# EAGLE schematic maincontroller (EAGLE 7.2.0)
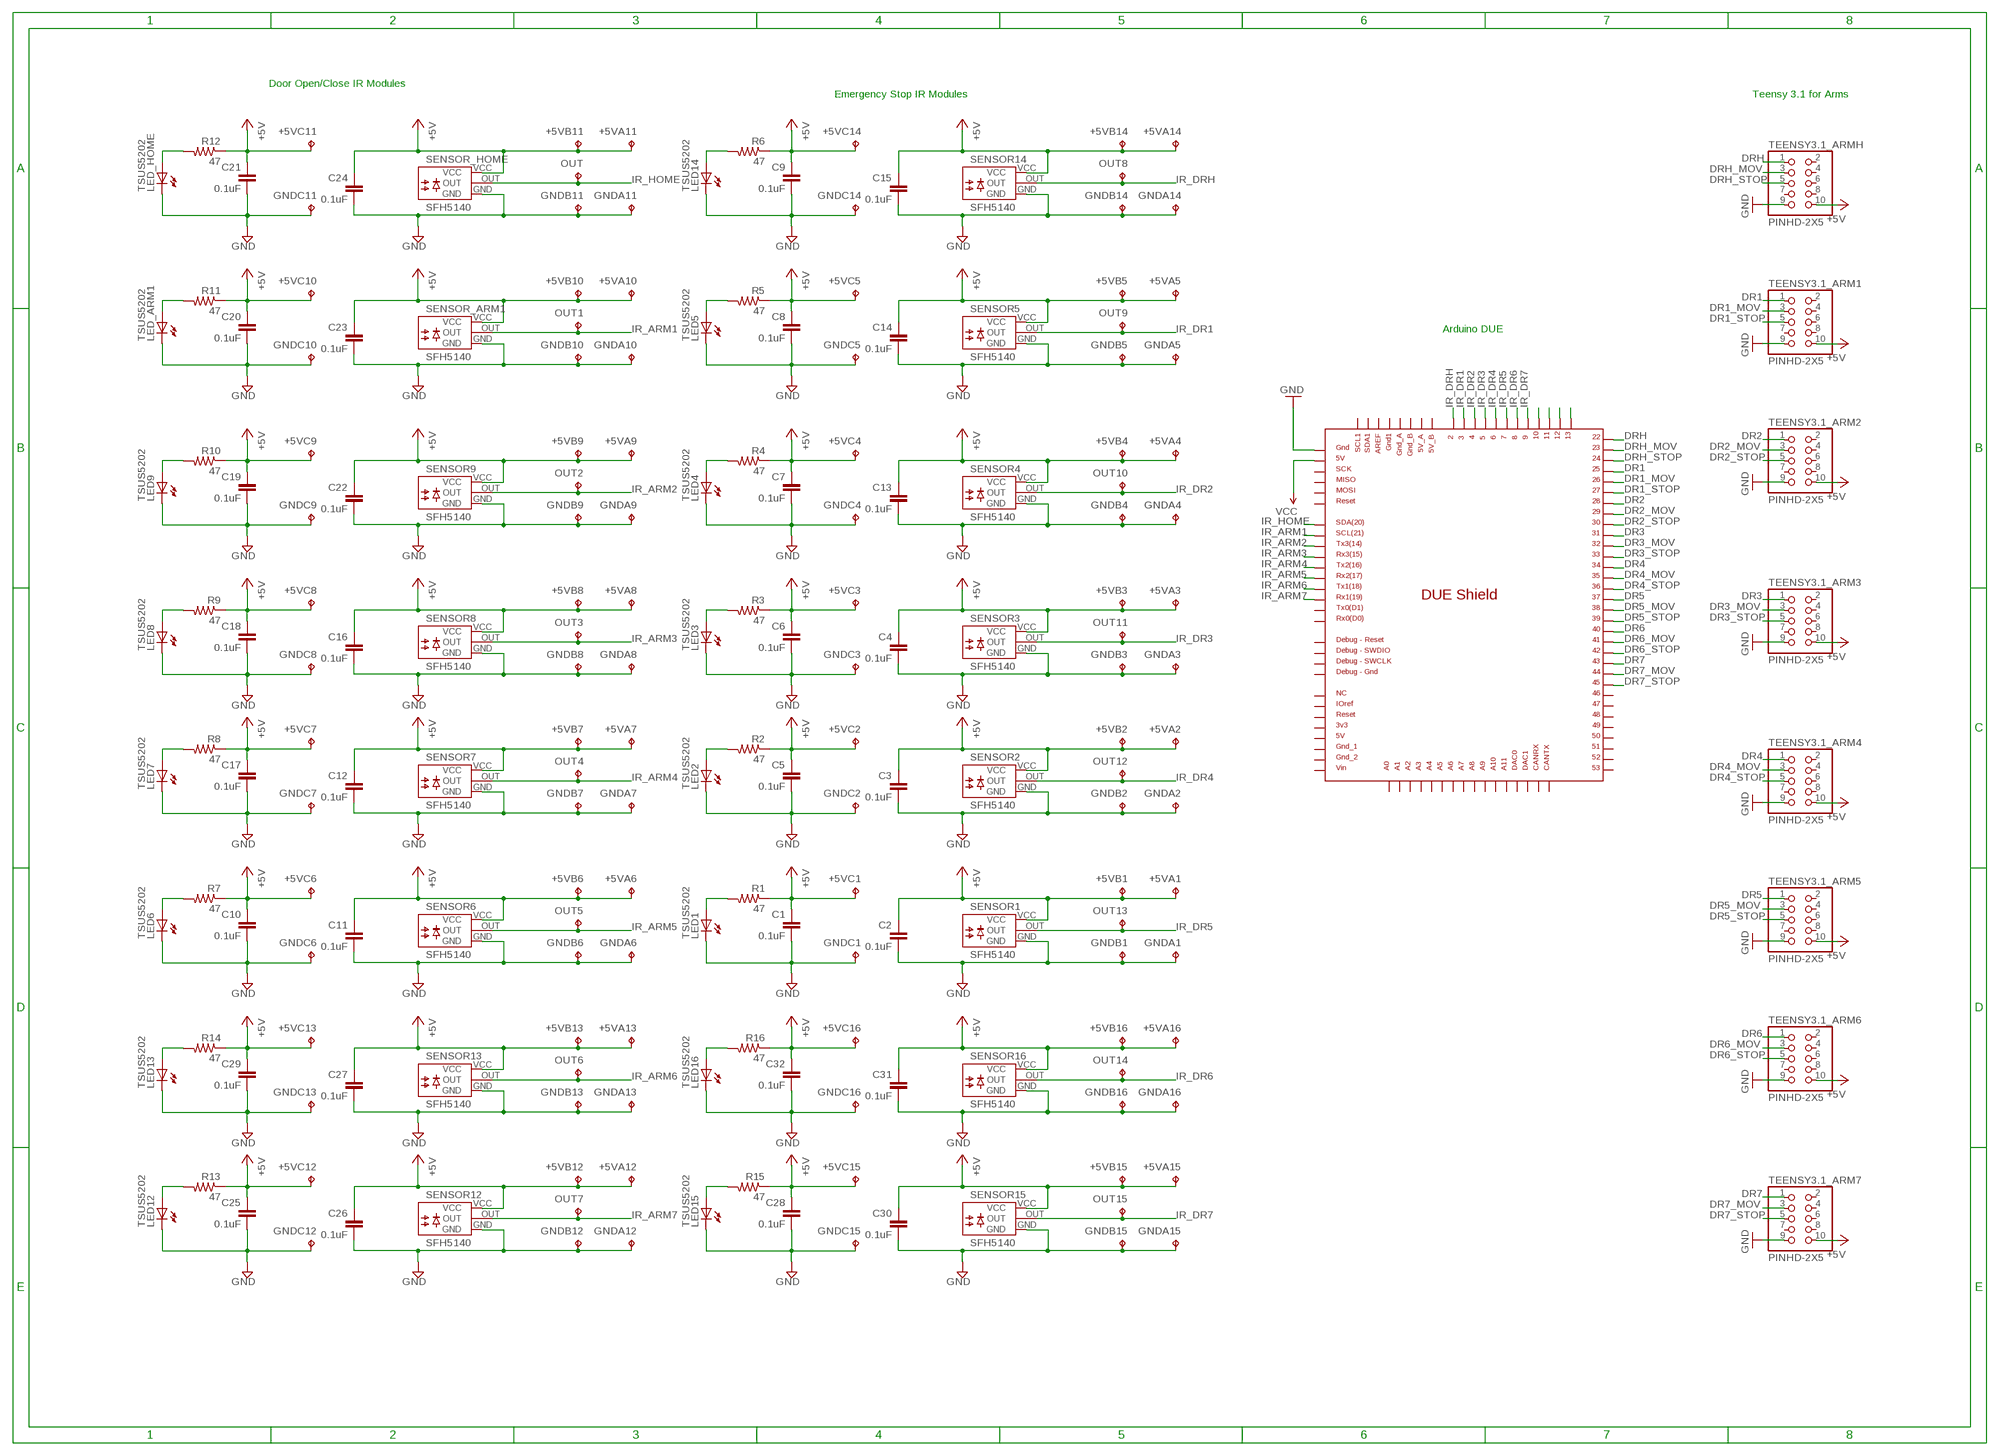
[diagram p0: schematic, sheet 1]

## Parts
+5VA1  TPPAD1-17Y  [P1-17Y]
+5VA2  TPPAD1-17Y  [P1-17Y]
+5VA3  TPPAD1-17Y  [P1-17Y]
+5VA4  TPPAD1-17Y  [P1-17Y]
+5VA5  TPPAD1-17Y  [P1-17Y]
+5VA6  TPPAD1-17Y  [P1-17Y]
+5VA7  TPPAD1-17Y  [P1-17Y]
+5VA8  TPPAD1-17Y  [P1-17Y]
+5VA9  TPPAD1-17Y  [P1-17Y]
+5VA10  TPPAD1-17Y  [P1-17Y]
+5VA11  TPPAD1-17Y  [P1-17Y]
+5VA12  TPPAD1-17Y  [P1-17Y]
+5VA13  TPPAD1-17Y  [P1-17Y]
+5VA14  TPPAD1-17Y  [P1-17Y]
+5VA15  TPPAD1-17Y  [P1-17Y]
+5VA16  TPPAD1-17Y  [P1-17Y]
+5VB1  TPPAD1-17Y  [P1-17Y]
+5VB2  TPPAD1-17Y  [P1-17Y]
+5VB3  TPPAD1-17Y  [P1-17Y]
+5VB4  TPPAD1-17Y  [P1-17Y]
+5VB5  TPPAD1-17Y  [P1-17Y]
+5VB6  TPPAD1-17Y  [P1-17Y]
+5VB7  TPPAD1-17Y  [P1-17Y]
+5VB8  TPPAD1-17Y  [P1-17Y]
+5VB9  TPPAD1-17Y  [P1-17Y]
+5VB10  TPPAD1-17Y  [P1-17Y]
+5VB11  TPPAD1-17Y  [P1-17Y]
+5VB12  TPPAD1-17Y  [P1-17Y]
+5VB13  TPPAD1-17Y  [P1-17Y]
+5VB14  TPPAD1-17Y  [P1-17Y]
+5VB15  TPPAD1-17Y  [P1-17Y]
+5VB16  TPPAD1-17Y  [P1-17Y]
+5VC1  TPPAD1-17Y  [P1-17Y]
+5VC2  TPPAD1-17Y  [P1-17Y]
+5VC3  TPPAD1-17Y  [P1-17Y]
+5VC4  TPPAD1-17Y  [P1-17Y]
+5VC5  TPPAD1-17Y  [P1-17Y]
+5VC6  TPPAD1-17Y  [P1-17Y]
+5VC7  TPPAD1-17Y  [P1-17Y]
+5VC8  TPPAD1-17Y  [P1-17Y]
+5VC9  TPPAD1-17Y  [P1-17Y]
+5VC10  TPPAD1-17Y  [P1-17Y]
+5VC11  TPPAD1-17Y  [P1-17Y]
+5VC12  TPPAD1-17Y  [P1-17Y]
+5VC13  TPPAD1-17Y  [P1-17Y]
+5VC14  TPPAD1-17Y  [P1-17Y]
+5VC15  TPPAD1-17Y  [P1-17Y]
+5VC16  TPPAD1-17Y  [P1-17Y]
C1  0.1uF  C_0805  [0805]
C2  0.1uF  C_0805  [0805]
C3  0.1uF  C_0805  [0805]
C4  0.1uF  C_0805  [0805]
C5  0.1uF  C_0805  [0805]
C6  0.1uF  C_0805  [0805]
C7  0.1uF  C_0805  [0805]
C8  0.1uF  C_0805  [0805]
C9  0.1uF  C_0805  [0805]
C10  0.1uF  C_0805  [0805]
C11  0.1uF  C_0805  [0805]
C12  0.1uF  C_0805  [0805]
C13  0.1uF  C_0805  [0805]
C14  0.1uF  C_0805  [0805]
C15  0.1uF  C_0805  [0805]
C16  0.1uF  C_0805  [0805]
C17  0.1uF  C_0805  [0805]
C18  0.1uF  C_0805  [0805]
C19  0.1uF  C_0805  [0805]
C20  0.1uF  C_0805  [0805]
C21  0.1uF  C_0805  [0805]
C22  0.1uF  C_0805  [0805]
C23  0.1uF  C_0805  [0805]
C24  0.1uF  C_0805  [0805]
C25  0.1uF  C_0805  [0805]
C26  0.1uF  C_0805  [0805]
C27  0.1uF  C_0805  [0805]
C28  0.1uF  C_0805  [0805]
C29  0.1uF  C_0805  [0805]
C30  0.1uF  C_0805  [0805]
C31  0.1uF  C_0805  [0805]
C32  0.1uF  C_0805  [0805]
GNDA1  TPPAD1-17Y  [P1-17Y]
GNDA2  TPPAD1-17Y  [P1-17Y]
GNDA3  TPPAD1-17Y  [P1-17Y]
GNDA4  TPPAD1-17Y  [P1-17Y]
GNDA5  TPPAD1-17Y  [P1-17Y]
GNDA6  TPPAD1-17Y  [P1-17Y]
GNDA7  TPPAD1-17Y  [P1-17Y]
GNDA8  TPPAD1-17Y  [P1-17Y]
GNDA9  TPPAD1-17Y  [P1-17Y]
GNDA10  TPPAD1-17Y  [P1-17Y]
GNDA11  TPPAD1-17Y  [P1-17Y]
GNDA12  TPPAD1-17Y  [P1-17Y]
GNDA13  TPPAD1-17Y  [P1-17Y]
GNDA14  TPPAD1-17Y  [P1-17Y]
GNDA15  TPPAD1-17Y  [P1-17Y]
GNDA16  TPPAD1-17Y  [P1-17Y]
GNDB1  TPPAD1-17Y  [P1-17Y]
GNDB2  TPPAD1-17Y  [P1-17Y]
GNDB3  TPPAD1-17Y  [P1-17Y]
GNDB4  TPPAD1-17Y  [P1-17Y]
GNDB5  TPPAD1-17Y  [P1-17Y]
GNDB6  TPPAD1-17Y  [P1-17Y]
GNDB7  TPPAD1-17Y  [P1-17Y]
GNDB8  TPPAD1-17Y  [P1-17Y]
GNDB9  TPPAD1-17Y  [P1-17Y]
GNDB10  TPPAD1-17Y  [P1-17Y]
GNDB11  TPPAD1-17Y  [P1-17Y]
GNDB12  TPPAD1-17Y  [P1-17Y]
GNDB13  TPPAD1-17Y  [P1-17Y]
GNDB14  TPPAD1-17Y  [P1-17Y]
GNDB15  TPPAD1-17Y  [P1-17Y]
GNDB16  TPPAD1-17Y  [P1-17Y]
GNDC1  TPPAD1-17Y  [P1-17Y]
GNDC2  TPPAD1-17Y  [P1-17Y]
GNDC3  TPPAD1-17Y  [P1-17Y]
GNDC4  TPPAD1-17Y  [P1-17Y]
GNDC5  TPPAD1-17Y  [P1-17Y]
GNDC6  TPPAD1-17Y  [P1-17Y]
GNDC7  TPPAD1-17Y  [P1-17Y]
GNDC8  TPPAD1-17Y  [P1-17Y]
GNDC9  TPPAD1-17Y  [P1-17Y]
GNDC10  TPPAD1-17Y  [P1-17Y]
GNDC11  TPPAD1-17Y  [P1-17Y]
GNDC12  TPPAD1-17Y  [P1-17Y]
GNDC13  TPPAD1-17Y  [P1-17Y]
GNDC14  TPPAD1-17Y  [P1-17Y]
GNDC15  TPPAD1-17Y  [P1-17Y]
GNDC16  TPPAD1-17Y  [P1-17Y]
LED1  TSUS5202  LED_5MM-SIDE  [LED5MM-SIDE]
LED2  TSUS5202  LED_5MM-SIDE  [LED5MM-SIDE]
LED3  TSUS5202  LED_5MM-SIDE  [LED5MM-SIDE]
LED4  TSUS5202  LED_5MM-SIDE  [LED5MM-SIDE]
LED5  TSUS5202  LED_5MM-SIDE  [LED5MM-SIDE]
LED6  TSUS5202  LED_5MM-SIDE  [LED5MM-SIDE]
LED7  TSUS5202  LED_5MM-SIDE  [LED5MM-SIDE]
LED8  TSUS5202  LED_5MM-SIDE  [LED5MM-SIDE]
LED9  TSUS5202  LED_5MM-SIDE  [LED5MM-SIDE]
LED12  TSUS5202  LED_5MM-SIDE  [LED5MM-SIDE]
LED13  TSUS5202  LED_5MM-SIDE  [LED5MM-SIDE]
LED14  TSUS5202  LED_5MM-SIDE  [LED5MM-SIDE]
LED15  TSUS5202  LED_5MM-SIDE  [LED5MM-SIDE]
LED16  TSUS5202  LED_5MM-SIDE  [LED5MM-SIDE]
LED_ARM1  TSUS5202  LED_5MM-SIDE  [LED5MM-SIDE]
LED_HOME  TSUS5202  LED_5MM-SIDE  [LED5MM-SIDE]
OUT  TPPAD1-17Y  [P1-17Y]
OUT1  TPPAD1-17Y  [P1-17Y]
OUT2  TPPAD1-17Y  [P1-17Y]
OUT3  TPPAD1-17Y  [P1-17Y]
OUT4  TPPAD1-17Y  [P1-17Y]
OUT5  TPPAD1-17Y  [P1-17Y]
OUT6  TPPAD1-17Y  [P1-17Y]
OUT7  TPPAD1-17Y  [P1-17Y]
OUT8  TPPAD1-17Y  [P1-17Y]
OUT9  TPPAD1-17Y  [P1-17Y]
OUT10  TPPAD1-17Y  [P1-17Y]
OUT11  TPPAD1-17Y  [P1-17Y]
OUT12  TPPAD1-17Y  [P1-17Y]
OUT13  TPPAD1-17Y  [P1-17Y]
OUT14  TPPAD1-17Y  [P1-17Y]
OUT15  TPPAD1-17Y  [P1-17Y]
R1  47  R_2512  [2512]
R2  47  R_2512  [2512]
R3  47  R_2512  [2512]
R4  47  R_2512  [2512]
R5  47  R_2512  [2512]
R6  47  R_2512  [2512]
R7  47  R_2512  [2512]
R8  47  R_2512  [2512]
R9  47  R_2512  [2512]
R10  47  R_2512  [2512]
R11  47  R_2512  [2512]
R12  47  R_2512  [2512]
R13  47  R_2512  [2512]
R14  47  R_2512  [2512]
R15  47  R_2512  [2512]
R16  47  R_2512  [2512]
SENSOR1  SFH5140  PHOTOSENSOR_SFH  [OSRAM-SFH]
SENSOR2  SFH5140  PHOTOSENSOR_SFH  [OSRAM-SFH]
SENSOR3  SFH5140  PHOTOSENSOR_SFH  [OSRAM-SFH]
SENSOR4  SFH5140  PHOTOSENSOR_SFH  [OSRAM-SFH]
SENSOR5  SFH5140  PHOTOSENSOR_SFH  [OSRAM-SFH]
SENSOR6  SFH5140  PHOTOSENSOR_SFH  [OSRAM-SFH]
SENSOR7  SFH5140  PHOTOSENSOR_SFH  [OSRAM-SFH]
SENSOR8  SFH5140  PHOTOSENSOR_SFH  [OSRAM-SFH]
SENSOR9  SFH5140  PHOTOSENSOR_SFH  [OSRAM-SFH]
SENSOR12  SFH5140  PHOTOSENSOR_SFH  [OSRAM-SFH]
SENSOR13  SFH5140  PHOTOSENSOR_SFH  [OSRAM-SFH]
SENSOR14  SFH5140  PHOTOSENSOR_SFH  [OSRAM-SFH]
SENSOR15  SFH5140  PHOTOSENSOR_SFH  [OSRAM-SFH]
SENSOR16  SFH5140  PHOTOSENSOR_SFH  [OSRAM-SFH]
SENSOR_ARM1  SFH5140  PHOTOSENSOR_SFH  [OSRAM-SFH]
SENSOR_HOME  SFH5140  PHOTOSENSOR_SFH  [OSRAM-SFH]
TEENSY3.1_ARM1  PINHD-2X5  [2X05]
TEENSY3.1_ARM2  PINHD-2X5  [2X05]
TEENSY3.1_ARM3  PINHD-2X5  [2X05]
TEENSY3.1_ARM4  PINHD-2X5  [2X05]
TEENSY3.1_ARM5  PINHD-2X5  [2X05]
TEENSY3.1_ARM6  PINHD-2X5  [2X05]
TEENSY3.1_ARM7  PINHD-2X5  [2X05]
TEENSY3.1_ARMH  PINHD-2X5  [2X05]
U$1  DUE(NORMAL)  [DUE(NORMAL)]

## Nets
+5V: +5VA1.TP +5VA2.TP +5VA3.TP +5VA4.TP +5VA5.TP +5VA6.TP +5VA7.TP +5VA8.TP +5VA9.TP +5VA10.TP +5VA11.TP +5VA12.TP +5VA13.TP +5VA14.TP +5VA15.TP +5VA16.TP +5VB1.TP +5VB2.TP +5VB3.TP +5VB4.TP +5VB5.TP +5VB6.TP +5VB7.TP +5VB8.TP +5VB9.TP +5VB10.TP +5VB11.TP +5VB12.TP +5VB13.TP +5VB14.TP +5VB15.TP +5VB16.TP +5VC1.TP +5VC2.TP +5VC3.TP +5VC4.TP +5VC5.TP +5VC6.TP +5VC7.TP +5VC8.TP +5VC9.TP +5VC10.TP +5VC11.TP +5VC12.TP +5VC13.TP +5VC14.TP +5VC15.TP +5VC16.TP C1.1 C2.1 C3.1 C4.1 C5.1 C6.1 C7.1 C8.1 C9.1 C10.1 C11.1 C12.1 C13.1 C14.1 C15.1 C16.1 C17.1 C18.1 C19.1 C20.1 C21.1 C22.1 C23.1 C24.1 C25.1 C26.1 C27.1 C28.1 C29.1 C30.1 C31.1 C32.1 R1.1 R2.1 R3.1 R4.1 R5.1 R6.1 R7.1 R8.1 R9.1 R10.1 R11.1 R12.1 R13.1 R14.1 R15.1 R16.1 SENSOR1.VCC SENSOR2.VCC SENSOR3.VCC SENSOR4.VCC SENSOR5.VCC SENSOR6.VCC SENSOR7.VCC SENSOR8.VCC SENSOR9.VCC SENSOR12.VCC SENSOR13.VCC SENSOR14.VCC SENSOR15.VCC SENSOR16.VCC SENSOR_ARM1.VCC SENSOR_HOME.VCC TEENSY3.1_ARM1.10 TEENSY3.1_ARM2.10 TEENSY3.1_ARM3.10 TEENSY3.1_ARM4.10 TEENSY3.1_ARM5.10 TEENSY3.1_ARM6.10 TEENSY3.1_ARM7.10 TEENSY3.1_ARMH.10 U$1.GND_ICSP ; supply symbol labelled VCC
DR1: TEENSY3.1_ARM1.1 U$1.25
DR1_MOV: TEENSY3.1_ARM1.3 U$1.26
DR1_STOP: TEENSY3.1_ARM1.5 U$1.27
DR2: TEENSY3.1_ARM2.1 U$1.28
DR2_MOV: TEENSY3.1_ARM2.3 U$1.29
DR2_STOP: TEENSY3.1_ARM2.5 U$1.30
DR3: TEENSY3.1_ARM3.1 U$1.31
DR3_MOV: TEENSY3.1_ARM3.3 U$1.32
DR3_STOP: TEENSY3.1_ARM3.5 U$1.33
DR4: TEENSY3.1_ARM4.1 U$1.34
DR4_MOV: TEENSY3.1_ARM4.3 U$1.35
DR4_STOP: TEENSY3.1_ARM4.5 U$1.36
DR5: TEENSY3.1_ARM5.1 U$1.37
DR5_MOV: TEENSY3.1_ARM5.3 U$1.38
DR5_STOP: TEENSY3.1_ARM5.5 U$1.39
DR6: TEENSY3.1_ARM6.1 U$1.40
DR6_MOV: TEENSY3.1_ARM6.3 U$1.41
DR6_STOP: TEENSY3.1_ARM6.5 U$1.42
DR7: TEENSY3.1_ARM7.1 U$1.43
DR7_MOV: TEENSY3.1_ARM7.3 U$1.44
DR7_STOP: TEENSY3.1_ARM7.5 U$1.45
DRH: TEENSY3.1_ARMH.1 U$1.22
DRH_MOV: TEENSY3.1_ARMH.3 U$1.23
DRH_STOP: TEENSY3.1_ARMH.5 U$1.24
GND: C1.2 C2.2 C3.2 C4.2 C5.2 C6.2 C7.2 C8.2 C9.2 C10.2 C11.2 C12.2 C13.2 C14.2 C15.2 C16.2 C17.2 C18.2 C19.2 C20.2 C21.2 C22.2 C23.2 C24.2 C25.2 C26.2 C27.2 C28.2 C29.2 C30.2 C31.2 C32.2 GNDA1.TP GNDA2.TP GNDA3.TP GNDA4.TP GNDA5.TP GNDA6.TP GNDA7.TP GNDA8.TP GNDA9.TP GNDA10.TP GNDA11.TP GNDA12.TP GNDA13.TP GNDA14.TP GNDA15.TP GNDA16.TP GNDB1.TP GNDB2.TP GNDB3.TP GNDB4.TP GNDB5.TP GNDB6.TP GNDB7.TP GNDB8.TP GNDB9.TP GNDB10.TP GNDB11.TP GNDB12.TP GNDB13.TP GNDB14.TP GNDB15.TP GNDB16.TP GNDC1.TP GNDC2.TP GNDC3.TP GNDC4.TP GNDC5.TP GNDC6.TP GNDC7.TP GNDC8.TP GNDC9.TP GNDC10.TP GNDC11.TP GNDC12.TP GNDC13.TP GNDC14.TP GNDC15.TP GNDC16.TP LED1.C LED2.C LED3.C LED4.C LED5.C LED6.C LED7.C LED8.C LED9.C LED12.C LED13.C LED14.C LED15.C LED16.C LED_ARM1.C LED_HOME.C SENSOR1.GND SENSOR2.GND SENSOR3.GND SENSOR4.GND SENSOR5.GND SENSOR6.GND SENSOR7.GND SENSOR8.GND SENSOR9.GND SENSOR12.GND SENSOR13.GND SENSOR14.GND SENSOR15.GND SENSOR16.GND SENSOR_ARM1.GND SENSOR_HOME.GND TEENSY3.1_ARM1.9 TEENSY3.1_ARM2.9 TEENSY3.1_ARM3.9 TEENSY3.1_ARM4.9 TEENSY3.1_ARM5.9 TEENSY3.1_ARM6.9 TEENSY3.1_ARM7.9 TEENSY3.1_ARMH.9 U$1.5V_ICSP
IR_ARM1: OUT1.TP SENSOR_ARM1.OUT U$1.SCL
IR_ARM2: OUT2.TP SENSOR9.OUT U$1.TX3
IR_ARM3: OUT3.TP SENSOR8.OUT U$1.RX3
IR_ARM4: OUT4.TP SENSOR7.OUT U$1.TX2
IR_ARM5: OUT5.TP SENSOR6.OUT U$1.RX2
IR_ARM6: OUT6.TP SENSOR13.OUT U$1.TX1
IR_ARM7: OUT7.TP SENSOR12.OUT U$1.RX1
IR_DR1: OUT9.TP SENSOR5.OUT U$1.3
IR_DR2: OUT10.TP SENSOR4.OUT U$1.4
IR_DR3: OUT11.TP SENSOR3.OUT U$1.5
IR_DR4: OUT12.TP SENSOR2.OUT U$1.6
IR_DR5: OUT13.TP SENSOR1.OUT U$1.7
IR_DR6: OUT14.TP SENSOR16.OUT U$1.8
IR_DR7: OUT15.TP SENSOR15.OUT U$1.9
IR_DRH: OUT8.TP SENSOR14.OUT U$1.2
IR_HOME: OUT.TP SENSOR_HOME.OUT U$1.SDA
N$1: LED1.A R1.2
N$5: LED2.A R2.2
N$6: LED3.A R3.2
N$7: LED4.A R4.2
N$8: LED5.A R5.2
N$9: LED14.A R6.2
N$10: LED6.A R7.2
N$17: LED7.A R8.2
N$18: LED8.A R9.2
N$19: LED9.A R10.2
N$20: LED_ARM1.A R11.2
N$21: LED_HOME.A R12.2
N$25: LED12.A R13.2
N$28: LED15.A R15.2
N$29: LED13.A R14.2
N$32: LED16.A R16.2
N$41: U$1.10
N$42: U$1.11
N$43: U$1.12
N$44: U$1.13
Unconnected: TEENSY3.1_ARM1.2 TEENSY3.1_ARM1.4 TEENSY3.1_ARM1.6 TEENSY3.1_ARM1.7 TEENSY3.1_ARM1.8 TEENSY3.1_ARM2.2 TEENSY3.1_ARM2.4 TEENSY3.1_ARM2.6 TEENSY3.1_ARM2.7 TEENSY3.1_ARM2.8 TEENSY3.1_ARM3.2 TEENSY3.1_ARM3.4 TEENSY3.1_ARM3.6 TEENSY3.1_ARM3.7 TEENSY3.1_ARM3.8 TEENSY3.1_ARM4.2 TEENSY3.1_ARM4.4 TEENSY3.1_ARM4.6 TEENSY3.1_ARM4.7 TEENSY3.1_ARM4.8 TEENSY3.1_ARM5.2 TEENSY3.1_ARM5.4 TEENSY3.1_ARM5.6 TEENSY3.1_ARM5.7 TEENSY3.1_ARM5.8 TEENSY3.1_ARM6.2 TEENSY3.1_ARM6.4 TEENSY3.1_ARM6.6 TEENSY3.1_ARM6.7 TEENSY3.1_ARM6.8 TEENSY3.1_ARM7.2 TEENSY3.1_ARM7.4 TEENSY3.1_ARM7.6 TEENSY3.1_ARM7.7 TEENSY3.1_ARM7.8 TEENSY3.1_ARMH.2 TEENSY3.1_ARMH.4 TEENSY3.1_ARMH.6 TEENSY3.1_ARMH.7 TEENSY3.1_ARMH.8 U$1.3V3 U$1.5V U$1.5V_A U$1.5V_B U$1.46 U$1.47 U$1.48 U$1.49 U$1.50 U$1.51 U$1.52 U$1.53 U$1.A0 U$1.A1 U$1.A2 U$1.A3 U$1.A4 U$1.A5 U$1.A6 U$1.A7 U$1.A8 U$1.A9 U$1.A10 U$1.A11 U$1.AREF U$1.CANRX U$1.CANTX U$1.DAC0 U$1.DAC1 U$1.GND1 U$1.GND_1 U$1.GND_2 U$1.GND_A U$1.GND_B U$1.GND_DEBUG U$1.IOREF U$1.MISO_ICSP U$1.MOSI_ICSP U$1.NC U$1.RESET U$1.RESET_DEBUG U$1.RESET_ICSP U$1.RX0 U$1.SCK_ICSP U$1.SCL1 U$1.SDA1 U$1.SWCLK_DEBUG U$1.SWDIO_DEBUG U$1.TX0 U$1.VIN

## Notes on the sheet
- Door Open/Close IR Modules
- Emergency Stop IR Modules | Teensy 3.1 for Arms
- Arduino DUE

## Library data of the parts
+5VA1-+5VA16 +5VB1-+5VB16 +5VC1-+5VC16 GNDA1-GNDA16 GNDB1-GNDB16 GNDC1-GNDC16 OUT OUT1-OUT15 = testpad:TP: Test pad
C1-C32 = jonnew:C: Capacitor; MN: TDK Corp.; PARTNO: C2012X5R1Cxxxxxxx; VID: DK
LED1-LED9 LED12-LED16 LED_ARM1 LED_HOME = jonnew:LED: Surface mount LED
R1-R16 = jonnew:R: Resistor
SENSOR1-SENSOR9 SENSOR12-SENSOR16 SENSOR_ARM1 SENSOR_HOME = jonnew:PHOTOSENSOR: OPTO SENSOR DEVICE
TEENSY3.1_ARM1-TEENSY3.1_ARM7 TEENSY3.1_ARMH = jonnew:PINHD-2X5
U$1 = DUElib130425:DUE(NORMAL)